# Altium schematic sheet WifiAntenna.SchDoc
size A
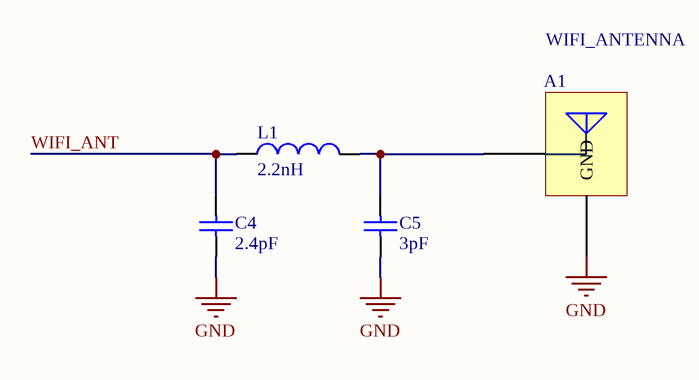
[diagram p0: WifiAntenna.SchDoc]

## Parts
A1  WIFI_ANTENNA  [PCB-wx81mnio3p969u8b8u4u-1]
C4  2.4pF  [CAPC1005X55X25ML05T10]
C5  3pF  [CAPC1005X55X25ML05T10]
L1  2.2nH  [PCB-vg5vda2wcniu3fh2gltx-1]

## Nets
GND: A1.2(GND) C4.1 C5.1
WIFI_ANT: C4.2 L1.1
NetA1_1: A1.1(A) C5.2 L1.2

## Library data of the parts
A1 = CMP-nvfputv9e4hvqhxbgt68-5: Meandered Inverted-F Antenna; CustomComponentID: nvfputv9e4hvqhxbgt68
C4 = CMP-119517-2: CAP CER 2.4PF 50V NP0 0402; Manufacturer Part Number: GJM1555C1H2R4CB01D; Capacitance: 2.4e-12 F; Dielectric Characteristic: C0G/NP0; Lead-Free Status: Lead Free; Voltage Rating (DC): 50.0 V; Mounting Style: Surface Mount; Octopart Url: https://octopart.com/gjm1555c1h2r4cb01d-murata-196712; OctopartID: 662aaf234324b9ed; RoHS: Compliant; Size-Height: 0.0005 m; Size-Length: 0.001 m; Size-Thickness: 0.0005 m; Size-Width: 0.0005 m
C5 = CMP-2512733-2: Multilayer Ceramic Capacitors MLCC - SMD/SMT 0402 3.0pF 50volts C0G +/-0.25pF; Manufacturer Part Number: GRM1555C1H3R0CA01D; Capacitance: 3e-12 F; Dielectric Characteristic: C0G/NP0; Lead-Free Status: Lead Free; Voltage Rating (DC): 50.0 V; Lifecycle Status: Active; Octopart Url: https://octopart.com/grm1555c1h3r0ca01d-murata-15748360; OctopartID: 3ee4f71e568ae123; REACH SVHC Compliance: No SVHC; RoHS: Compliant; Size-Length: 0.001 m; Size-Thickness: 0.0005 m; Size-Width: 0.0005 m
L1 = CMP-80494860bc425f8e-1: Inductor RF Chip Thin Film 2.2nH 0.1nH 500MHz 14Q-Factor 600mA 150mOhm DCR 0201 Paper T/R; Manufacturer Part Number: LQP03TN2N2B02D; Inductance: 2.20 nH; Packaging: Cut Tape (CT); Octopart URL: https://octopart.com/lqp03tn2n2b02d-murata-19077485; Lifecycle Status: Active